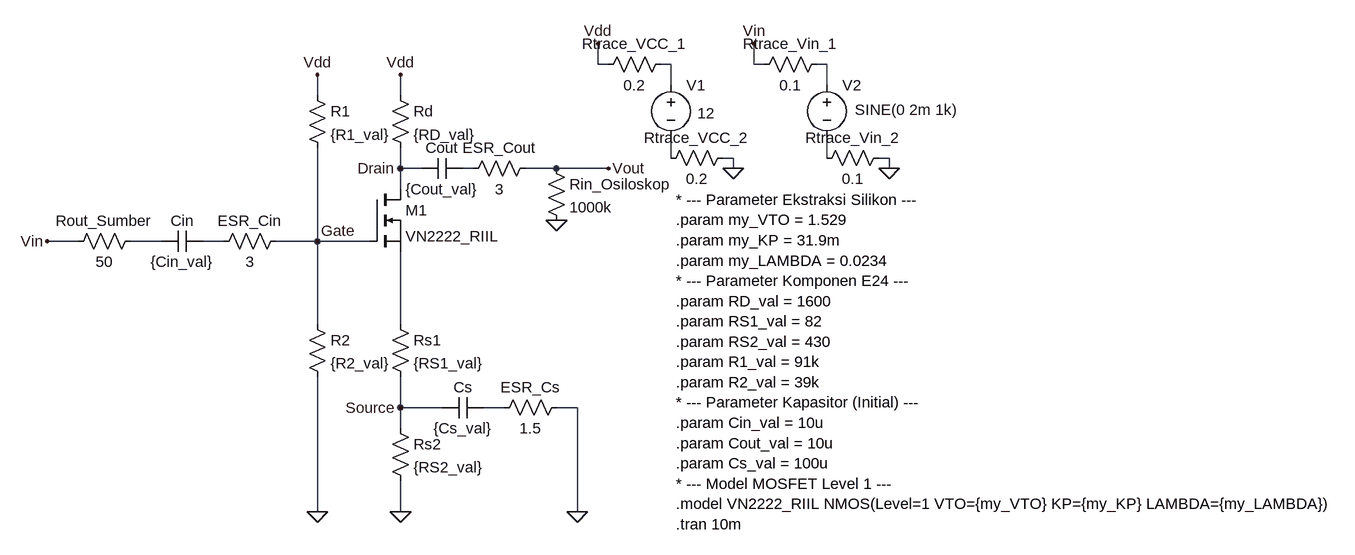
[diagram p0: schematic CS_Amp_Baseline_LoadEffect_Parasitics.asc]
CS_Amp_Baseline_LoadEffect_Parasitics.asc, the LTspice schematic file:
Version 4
SHEET 1 2624 1128
WIRE -32 0 -32 -32
WIRE -16 0 -32 0
WIRE 80 0 64 0
WIRE 208 0 208 -32
WIRE 224 0 208 0
WIRE 320 0 304 0
WIRE 80 32 80 0
WIRE 320 32 320 0
WIRE -464 48 -464 16
WIRE -336 48 -336 16
WIRE 80 144 80 112
WIRE 176 144 160 144
WIRE 320 144 320 112
WIRE 416 144 400 144
WIRE -336 160 -336 128
WIRE -304 160 -336 160
WIRE -224 160 -240 160
WIRE -96 160 -144 160
WIRE -16 160 -96 160
WIRE 176 160 176 144
WIRE 416 160 416 144
WIRE -336 192 -336 160
WIRE -832 272 -880 272
WIRE -704 272 -752 272
WIRE -608 272 -640 272
WIRE -464 272 -464 128
WIRE -464 272 -528 272
WIRE -384 272 -464 272
WIRE -464 400 -464 272
WIRE -336 400 -336 288
WIRE -336 528 -336 480
WIRE -272 528 -336 528
WIRE -176 528 -208 528
WIRE -64 528 -96 528
WIRE -336 560 -336 528
WIRE -464 688 -464 480
WIRE -336 688 -336 640
WIRE -64 688 -64 528
FLAG -336 688 0
FLAG -336 16 Vdd
FLAG -464 688 0
FLAG -464 16 Vdd
FLAG -64 688 0
FLAG 176 160 0
FLAG -32 -32 Vdd
FLAG -16 160 Vout
FLAG -880 272 Vin
FLAG 416 160 0
FLAG 208 -32 Vin
FLAG -336 160 Drain
FLAG -464 272 Gate
FLAG -336 528 Source
FLAG -96 240 0
SYMBOL nmos -384 192 R0
SYMATTR InstName M1
SYMATTR Value VN2222_RIIL
SYMBOL Res -352 384 R0
SYMATTR InstName Rs1
SYMATTR Value {RS1_val}
SYMBOL Res -352 32 R0
SYMATTR InstName Rd
SYMATTR Value {RD_val}
SYMBOL Res -352 544 R0
SYMATTR InstName Rs2
SYMATTR Value {RS2_val}
SYMBOL Res -480 32 R0
SYMATTR InstName R1
SYMATTR Value {R1_val}
SYMBOL Res -480 384 R0
SYMATTR InstName R2
SYMATTR Value {R2_val}
SYMBOL Cap -208 512 R90
WINDOW 0 0 32 VBottom 2
WINDOW 3 32 32 VTop 2
SYMATTR InstName Cs
SYMATTR Value {Cs_val}
SYMATTR SpiceLine V=al}\
SYMBOL Voltage 80 16 R0
WINDOW 3 41 59 Left 2
SYMATTR InstName V1
SYMATTR Value 12
SYMBOL Cap -640 256 R90
WINDOW 0 0 32 VBottom 2
WINDOW 3 32 32 VTop 2
SYMATTR InstName Cin
SYMATTR Value {Cin_val}
SYMBOL Cap -240 144 R90
WINDOW 0 0 32 VBottom 2
WINDOW 3 32 32 VTop 2
SYMATTR InstName Cout
SYMATTR Value {Cout_val}
SYMBOL Voltage 320 16 R0
WINDOW 3 43 54 Left 2
SYMATTR InstName V2
SYMATTR Value SINE(0 2m 1k)
SYMBOL Res -112 144 R0
SYMATTR InstName Rin_Osiloskop
SYMATTR Value 1000k
SYMBOL Res -736 256 R90
WINDOW 0 0 56 VBottom 2
WINDOW 3 32 56 VTop 2
SYMATTR InstName Rout_Sumber
SYMATTR Value 50
SYMBOL Res 80 -16 R90
WINDOW 0 0 56 VBottom 2
WINDOW 3 32 56 VTop 2
SYMATTR InstName Rtrace_VCC_1
SYMATTR Value 0.2
SYMBOL Res 320 -16 R90
WINDOW 0 0 56 VBottom 2
WINDOW 3 32 56 VTop 2
SYMATTR InstName Rtrace_Vin_1
SYMATTR Value 0.1
SYMBOL Res -512 256 R90
WINDOW 0 0 56 VBottom 2
WINDOW 3 32 56 VTop 2
SYMATTR InstName ESR_Cin
SYMATTR Value 3
SYMBOL Res -80 512 R90
WINDOW 0 0 56 VBottom 2
WINDOW 3 32 56 VTop 2
SYMATTR InstName ESR_Cs
SYMATTR Value 1.5
SYMBOL Res -128 144 R90
WINDOW 0 0 56 VBottom 2
WINDOW 3 32 56 VTop 2
SYMATTR InstName ESR_Cout
SYMATTR Value 3
SYMBOL Res 176 128 R90
WINDOW 0 0 56 VBottom 2
WINDOW 3 32 56 VTop 2
SYMATTR InstName Rtrace_VCC_2
SYMATTR Value 0.2
SYMBOL Res 416 128 R90
WINDOW 0 0 56 VBottom 2
WINDOW 3 32 56 VTop 2
SYMATTR InstName Rtrace_Vin_2
SYMATTR Value 0.1
TEXT 88 208 Left 2 !* --- Parameter Ekstraksi Silikon ---\n.param my_VTO = 1.529\n.param my_KP = 31.9m\n.param my_LAMBDA = 0.0234\n* --- Parameter Komponen E24 ---\n.param RD_val = 1600\n.param RS1_val = 82\n.param RS2_val = 430\n.param R1_val = 91k\n.param R2_val = 39k\n* --- Parameter Kapasitor (Initial) ---\n.param Cin_val = 10u\n.param Cout_val = 10u\n.param Cs_val = 100u\n* --- Model MOSFET Level 1 ---\n.model VN2222_RIIL NMOS(Level=1 VTO={my_VTO} KP={my_KP} LAMBDA={my_LAMBDA})\n.tran 10m

The netlist it stands for:
* CS_Amp_Baseline_LoadEffect_Parasitics.asc
M1 Drain Gate N008 N008 VN2222_RIIL
Rs1 N008 Source {RS1_val}
Rd Vdd Drain {RD_val}
Rs2 Source 0 {RS2_val}
R1 Vdd Gate {R1_val}
R2 Gate 0 {R2_val}
Cs N009 Source {Cs_val} V=al}\
V1 N001 N003 12
Cin N007 N006 {Cin_val}
Cout N005 Drain {Cout_val}
V2 N002 N004 SINE(0 2m 1k)
Rin_Osiloskop Vout 0 1000k
Rout_Sumber N006 Vin 50
Rtrace_VCC_1 N001 Vdd 0.2
Rtrace_Vin_1 N002 Vin 0.1
R§ESR_Cin Gate N007 3
R§ESR_Cs 0 N009 1.5
R§ESR_Cout Vout N005 3
Rtrace_VCC_2 0 N003 0.2
Rtrace_Vin_2 0 N004 0.1
.model NMOS NMOS
.model PMOS PMOS
.lib standard.mos
* --- Parameter Ekstraksi Silikon ---
.param my_VTO = 1.529
.param my_KP = 31.9m
.param my_LAMBDA = 0.0234
* --- Parameter Komponen E24 ---
.param RD_val = 1600
.param RS1_val = 82
.param RS2_val = 430
.param R1_val = 91k
.param R2_val = 39k
* --- Parameter Kapasitor (Initial) ---
.param Cin_val = 10u
.param Cout_val = 10u
.param Cs_val = 100u
* --- Model MOSFET Level 1 ---
.model VN2222_RIIL NMOS(Level=1 VTO={my_VTO} KP={my_KP} LAMBDA={my_LAMBDA})
.tran 10m
.backanno
.end